# EAGLE design ext_BME280 (EAGLE 7.3.0)
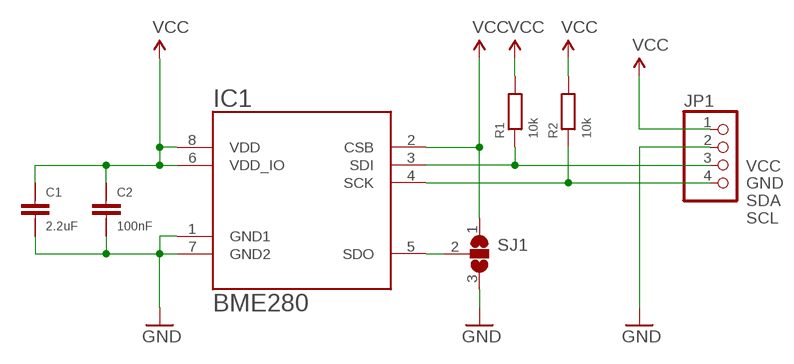
[diagram p0: schematic, sheet 1]

## Parts
C1  2.2uF  CAP-0402  [0402]
C2  100nF  CAP-0402  [0402]
IC1  BME280  BME280_BME280  [BME280_BME280]
JP1  PINHD-1X4  [1X04]
R1  10k  RES-0402  [0402]
R2  10k  RES-0402  [0402]
SJ1  SJ2W  [SJ_2]

## Nets
GND: C1.P$1 C2.P$1 IC1.1(GND1) IC1.7(GND2) JP1.2 SJ1.3
N$1: IC1.5(SDO) SJ1.2
N$3: IC1.3(SDI) JP1.3 R1.P$1
N$4: IC1.4(SCK) JP1.4 R2.P$1
VCC: C1.P$2 C2.P$2 IC1.2(CSB) IC1.6(VDD_IO) IC1.8(VDD) JP1.1 R1.P$2 R2.P$2 SJ1.1

## Notes on the sheet
- VCC
  GND
  SDA
  SCL

## Library data of the parts
C1 C2 = sven:CAP-0402
IC1 = EXTERNAL_BME280:BME280_BME280
JP1 = pinhead:PINHD-1X4: PIN HEADER
R1 R2 = sven:RES-0402
SJ1 = jumper:SJ2W: SMD solder JUMPER

## Board
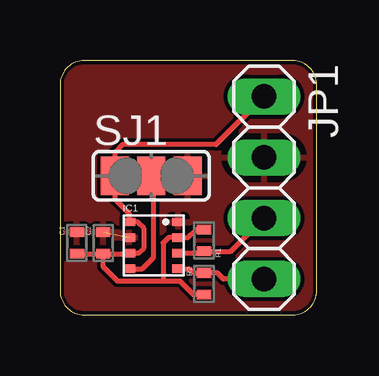
[diagram p1: board, top side]
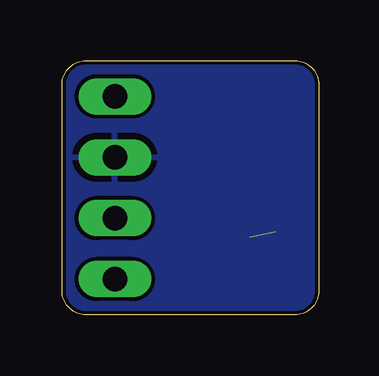
[diagram p2: board, bottom side, seen from below]

Size 10.7 x 10.6 mm. Coordinates in mm from the lower left corner, seen from the top.
Outline: 1,0 9.7,0 arc90 10.7,1 10.7,9.6 arc90 9.7,10.6 1,10.6 arc90 0,9.6 0,1 arc90 1,0
Copper layers (1*16): Top 0.035mm / dielectric 1.5mm / Bottom 0.035mm
Design rules "hackvana": minimum track width 6mil, minimum drill 0.3mm, track to track 6mil, track to pad 6mil, pad to pad 6mil, via to via 6mil, smd to smd 0mil, copper to edge 6mil, drill to drill 6mil, minimum pad ring 10mil, minimum via ring 6mil, stop-mask expansion 2mil, vias tented up to drill 100mil, thermal gap 10mil

### Footprints (pad centres in the part's own frame; a part is rotated, then mirrored left to right if it is on the bottom)
0402 = smd 0.4 x 0.6: P$1 -0.45,0; P$2 0.45,0
BME280_BME280 = smd 0.5 x 0.35: 1 1.025,0.975; 2 1.025,0.325; 3 1.025,-0.325; 4 1.025,-0.975; 5 -1.025,-0.975; 6 -1.025,-0.325; 7 -1.025,0.325; 8 -1.025,0.975
1X04 = drill 1.016 long: 1 -3.81,0; 2 -1.27,0; 3 1.27,0; 4 3.81,0
SJ_2 = smd 1.168 x 1.6: 1 -1.524,0; 2 0,0; 3 1.524,0

### Placement (x,y rotation side)
C1  0.7,3 270 top
C2  1.8,3 270 top
IC1  3.9,2.9 0 top
JP1  8.5,5.3 270 top
R1  6,3.1 90 top
R2  6,1.3 270 top
SJ1  3.8,5.8 0 top

### Tracks (layer width: path | path; a pad name or v marks a point on that pad's centre or on a via)
GND  (1 unrouted)
  pour Bottom: 1,10.6 9.7,10.6 arc-90 10.7,9.6 10.7,1 arc-90 9.7,0 1,0 arc-90 0,1 0,9.6 arc-90
  pour Top: 1,10.6 9.7,10.6 arc-90 10.7,9.6 10.7,1 arc-90 9.7,0 1,0 arc-90 0,1 0,9.6 arc-90
N$1
  Top 0.2: IC1.5 3.42,1.93 3.9,2.4 3.9,5.8 SJ1.2
N$3
  Top 0.2: IC1.3 5.83,2.58 R1.P$1 7.12,2.65 JP1.3
N$4
  Top 0.2: JP1.4 6.81,1.49 6.55,1.75 R2.P$1 5.55,1.75 5.38,1.93 IC1.4
VCC
  Top 0.2: C1.P$2 C2.P$2 | C2.P$2 2.85,2.55 arc90 IC1.6 3.27,2.58 3.5,2.8 3.5,3.6 3.23,3.88 IC1.8 2.88,4.22 2.28,4.82 SJ1.1 2.28,6.78 2.6,7.1 6.49,7.1 JP1.1 | C2.P$2 1.8,2 2.4,1.4 4.3,1.4 | R1.P$2 5.65,3.55 5.33,3.23 IC1.2 4.53,3.23 4.3,3 4.3,1.4 | R2.P$2 5.55,0.85 5,1.4 4.3,1.4

### Text on the board
tTest: Address / 0x77 0x76